# EAGLE design bateria EPS (EAGLE 9.6.1)
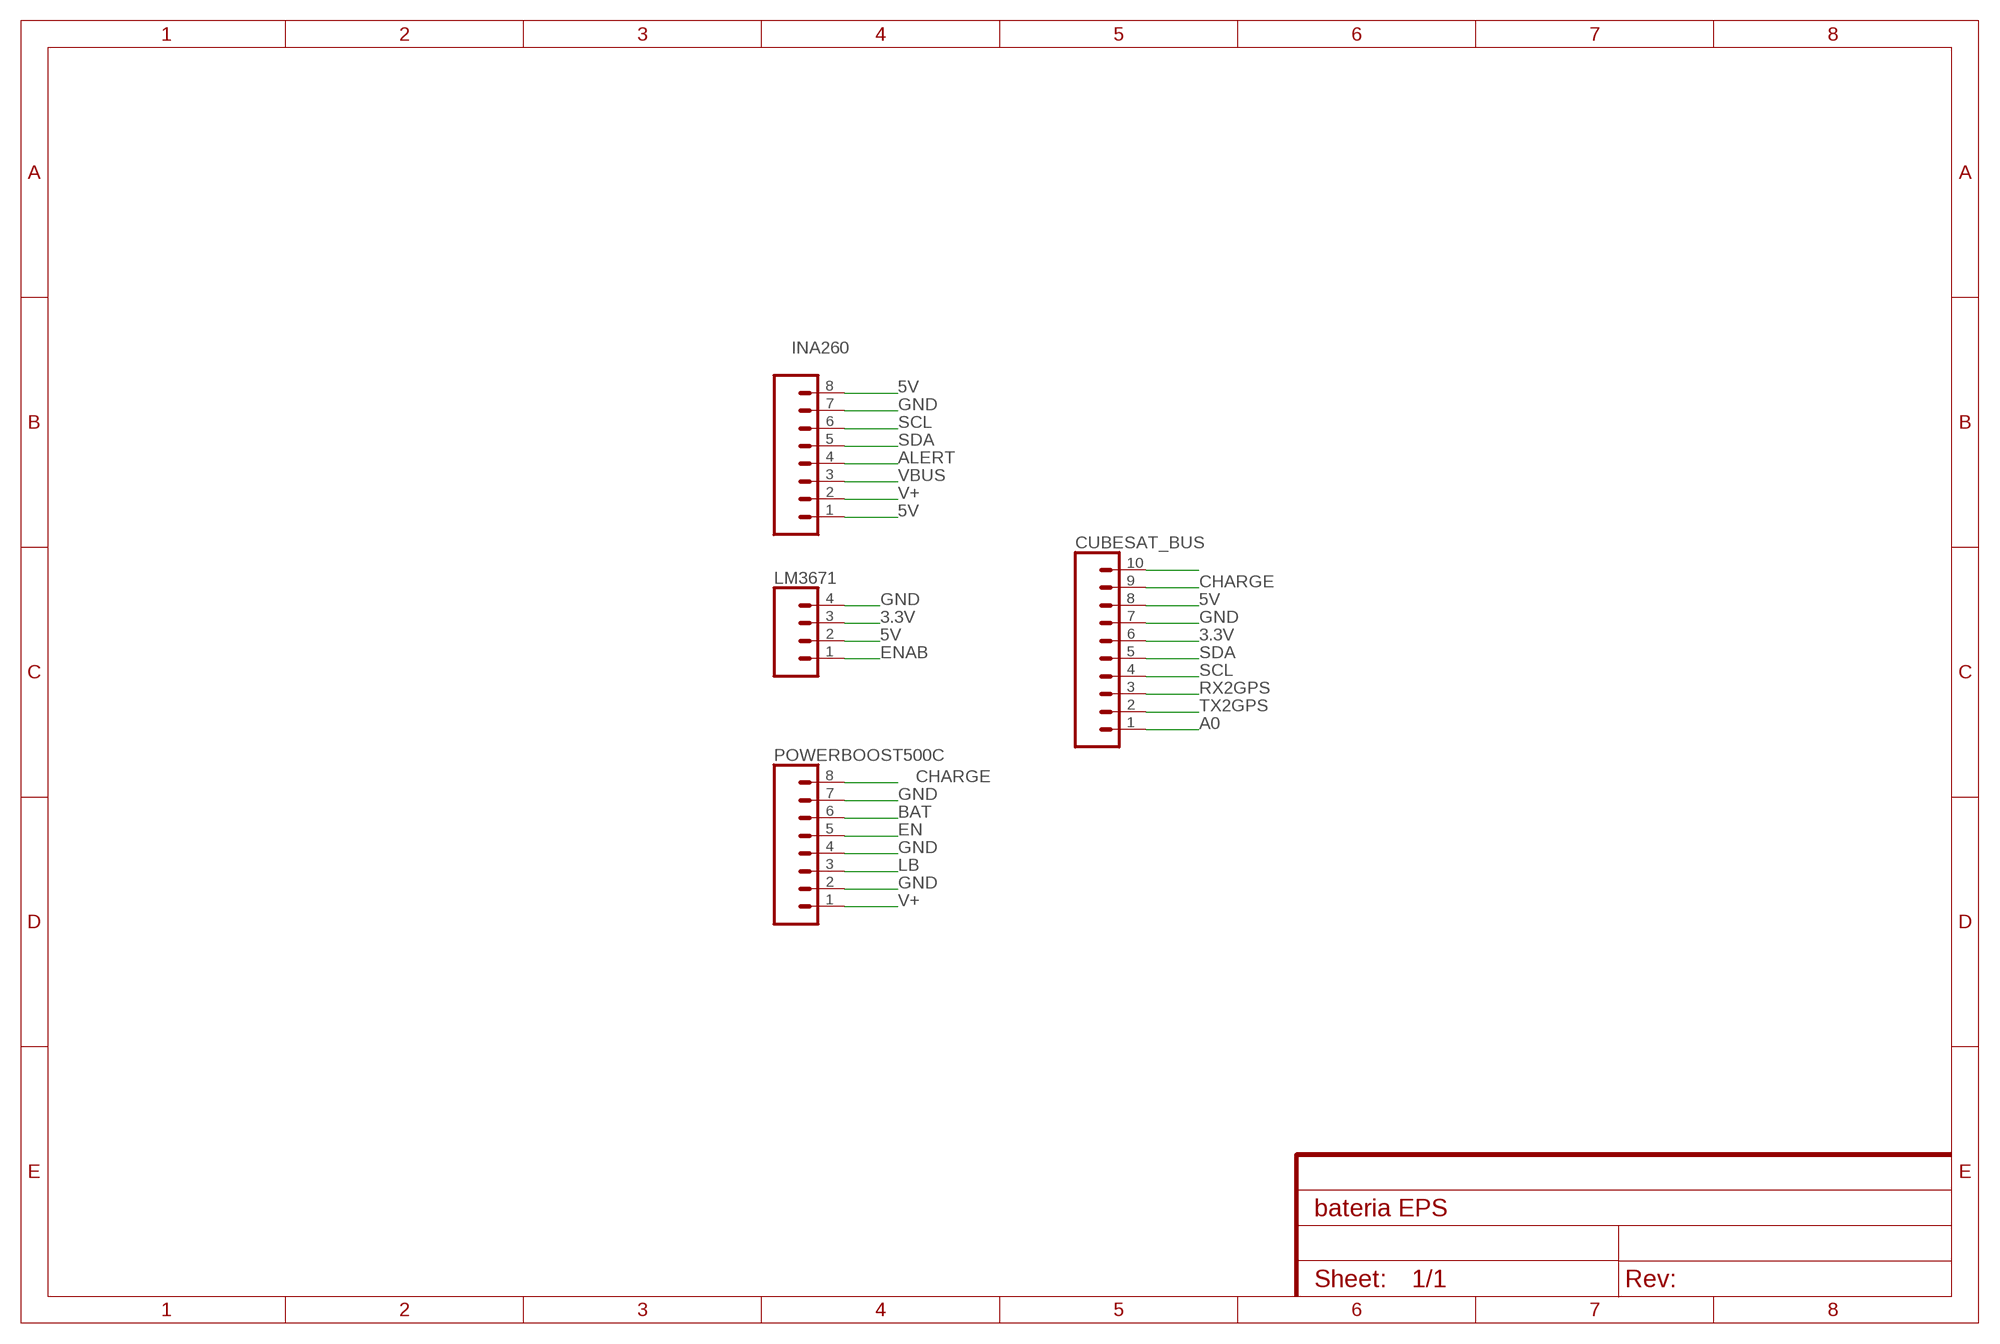
[diagram p0: schematic, sheet 1]

## Parts
CUBESAT_BUS  CONN_10"  [1X10]
INA260  CONN_08"  [1X08]
LM3671  CONN_04PTH  [1X04]
POWERBOOST500C  CONN_08"  [1X08]

## Nets
3.3V: CUBESAT_BUS.6 LM3671.3
5V: CUBESAT_BUS.8 INA260.1 INA260.8 LM3671.2
A0: CUBESAT_BUS.1
ALERT: INA260.4
BAT: POWERBOOST500C.6
CHARGE: CUBESAT_BUS.9 POWERBOOST500C.8
EN: POWERBOOST500C.5
ENAB: LM3671.1
GND: CUBESAT_BUS.7 INA260.7 LM3671.4 POWERBOOST500C.2 POWERBOOST500C.4 POWERBOOST500C.7
LB: POWERBOOST500C.3
N$20: CUBESAT_BUS.10
RX2GPS: CUBESAT_BUS.3
SCL: CUBESAT_BUS.4 INA260.6
SDA: CUBESAT_BUS.5 INA260.5
TX2GPS: CUBESAT_BUS.2
V+: INA260.2 POWERBOOST500C.1
VBUS: INA260.3

## Library data of the parts
CUBESAT_BUS = SparkFun-Connectors:CONN_10: Multi connection point. Often used as Generic Header-pin footprint for 0.1 inch spaced/style header connections On any of the 0.1 inch spaced packages, you can populate with these: Break Away Headers - Straight <https://www.sparkfun.com/products/116> (PRT-00116) Break Away Male Headers - Right Angle <https://www.sparkfun.com/products/553> (PRT-00553) Female Headers <https://www.sparkfun.com/products/115> (PRT-00115) Break Away Headers - Machine Pin <https://www.sparkfun.com/products/117> (PRT-00117) Break Away Female Headers - Swiss Machine Pin <https://www.sparkfun.com/products/743> (PRT-00743) Arduino Stackable Header - 10 Pin <https://www.sparkfun.com/products/11376> (PRT-11376) For SCREWTERMINALS and SPRING TERMINALS visit here: Screw Terimnals on SparkFun.com <https://www.sparkfun.com/search/results?term=Screw+Terminals> (5mm/3.5mm/2.54mm spacing) This device is also useful as a general connection point to wire up your design to another part of your project. Our various solder wires solder well into these plated through hole pads. Hook-Up Wire - Assortment (Stranded, 22 AWG) <https://www.sparkfun.com/products/11375> (PRT-11375) Hook-Up Wire - Assortment (Solid Core, 22 AWG) <https://www.sparkfun.com/products/11367> (PRT-11367) View the entire wire category on our website here <https://www.sparkfun.com/categories/141> Special notes: Molex polarized connector foot print use with SKU : PRT-08231 with associated crimp pins and housings. 1MM SMD Version SKU: PRT-10208 NOTES ON THE VARIANTS LOCK and LOCK_LONGPADS... This footprint was designed to help hold the alignment of a through-hole component (i.e. 6-pin header) while soldering it into place. You may notice that each hole has been shifted either up or down by 0.005 of an inch from it's more standard position (which is a perfectly straight line). This slight alteration caused the pins (the squares in the middle) to touch the edges of the holes. Because they are alternating, it causes a "brace" to hold the component in place. 0.005 has proven to be the perfect amount of "off-center" position when using our standard breakaway headers. Although looks a little odd when you look at the bare footprint, once you have a header in there, the alteration is very hard to notice. Also,if you push a header all the way into place, it is covered up entirely on the bottom side.; PROD_ID: CONN-11563
INA260 POWERBOOST500C = SparkFun-Connectors:CONN_08: Multi connection point. Often used as Generic Header-pin footprint for 0.1 inch spaced/style header connections On any of the 0.1 inch spaced packages, you can populate with these: Break Away Headers - Straight <https://www.sparkfun.com/products/116> (PRT-00116) Break Away Male Headers - Right Angle <https://www.sparkfun.com/products/553> (PRT-00553) Female Headers <https://www.sparkfun.com/products/115> (PRT-00115) Break Away Headers - Machine Pin <https://www.sparkfun.com/products/117> (PRT-00117) Break Away Female Headers - Swiss Machine Pin <https://www.sparkfun.com/products/743> (PRT-00743) Arduino Stackable Header - 8 Pin <https://www.sparkfun.com/products/9279> (PRT-09279) For SCREWTERMINALS and SPRING TERMINALS visit here: Screw Terimnals on SparkFun.com <https://www.sparkfun.com/search/results?term=Screw+Terminals> (5mm/3.5mm/2.54mm spacing) This device is also useful as a general connection point to wire up your design to another part of your project. Our various solder wires solder well into these plated through hole pads. Hook-Up Wire - Assortment (Stranded, 22 AWG) <https://www.sparkfun.com/products/11375> (PRT-11375) Hook-Up Wire - Assortment (Solid Core, 22 AWG) <https://www.sparkfun.com/products/11367> (PRT-11367) View the entire wire category on our website here <https://www.sparkfun.com/categories/141> Special notes: Molex polarized connector foot print use with SKU : PRT-08231 with associated crimp pins and housings. 1MM SMD Version SKU: PRT-10208 NOTES ON THE VARIANTS LOCK and LOCK_LONGPADS... This footprint was designed to help hold the alignment of a through-hole component (i.e. 6-pin header) while soldering it into place. You may notice that each hole has been shifted either up or down by 0.005 of an inch from it's more standard position (which is a perfectly straight line). This slight alteration caused the pins (the squares in the middle) to touch the edges of the holes. Because they are alternating, it causes a "brace" to hold the component in place. 0.005 has proven to be the perfect amount of "off-center" position when using our standard breakaway headers. Although looks a little odd when you look at the bare footprint, once you have a header in there, the alteration is very hard to notice. Also,if you push a header all the way into place, it is covered up entirely on the bottom side.; PROD_ID: CONN-08438
LM3671 = SparkFun-Connectors:CONN_04: Multi connection point. Often used as Generic Header-pin footprint for 0.1 inch spaced/style header connections On any of the 0.1 inch spaced packages, you can populate with these: Break Away Headers - Straight <https://www.sparkfun.com/products/116> (PRT-00116) Break Away Male Headers - Right Angle <https://www.sparkfun.com/products/553> (PRT-00553) Female Headers <https://www.sparkfun.com/products/115> (PRT-00115) Break Away Headers - Machine Pin <https://www.sparkfun.com/products/117> (PRT-00117) Break Away Female Headers - Swiss Machine Pin <https://www.sparkfun.com/products/743> (PRT-00743) For SCREWTERMINALS and SPRING TERMINALS visit here: Screw Terimnals on SparkFun.com <https://www.sparkfun.com/search/results?term=Screw+Terminals> (5mm/3.5mm/2.54mm spacing) This device is also useful as a general connection point to wire up your design to another part of your project. Our various solder wires solder well into these plated through hole pads. Hook-Up Wire - Assortment (Stranded, 22 AWG) <https://www.sparkfun.com/products/11375> (PRT-11375) Hook-Up Wire - Assortment (Solid Core, 22 AWG) <https://www.sparkfun.com/products/11367> (PRT-11367) View the entire wire category on our website here <https://www.sparkfun.com/categories/141> Special notes: Molex polarized connector foot print use with SKU : PRT-08231 with associated crimp pins and housings. 1MM SMD Version SKU: PRT-10208; PROD_ID: CONN-09696

## Board
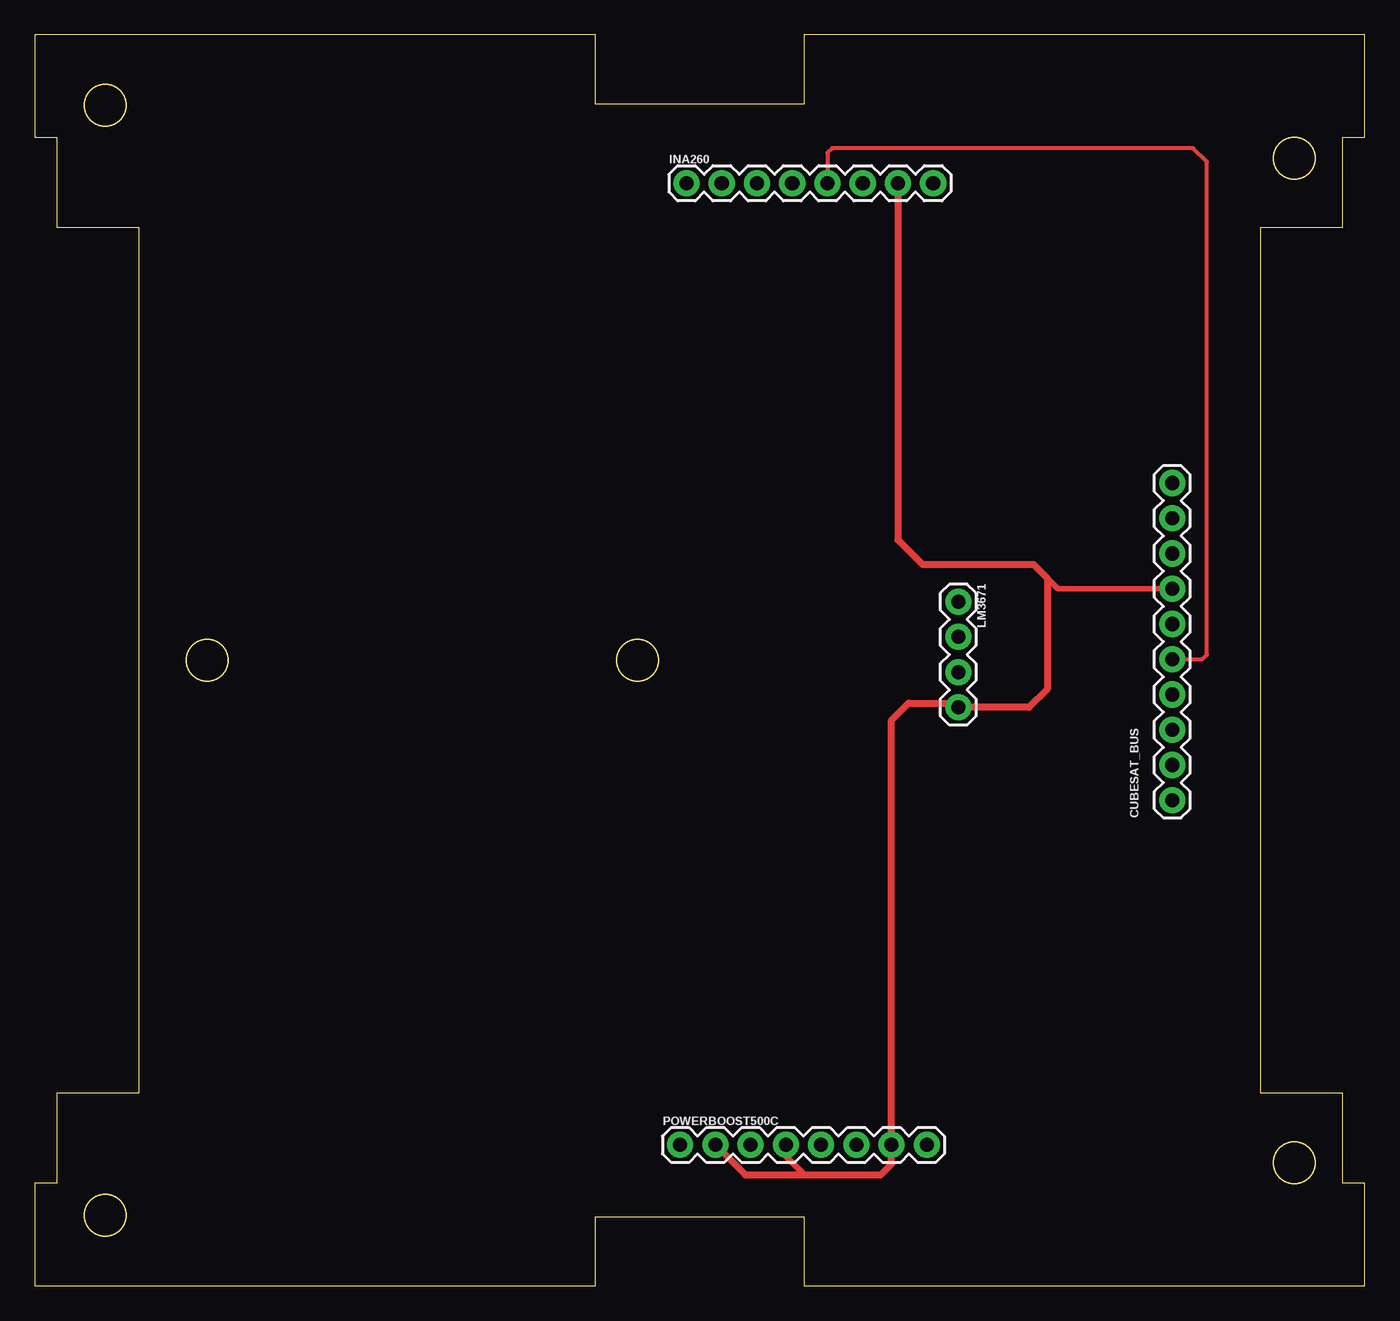
[diagram p1: board, top side]
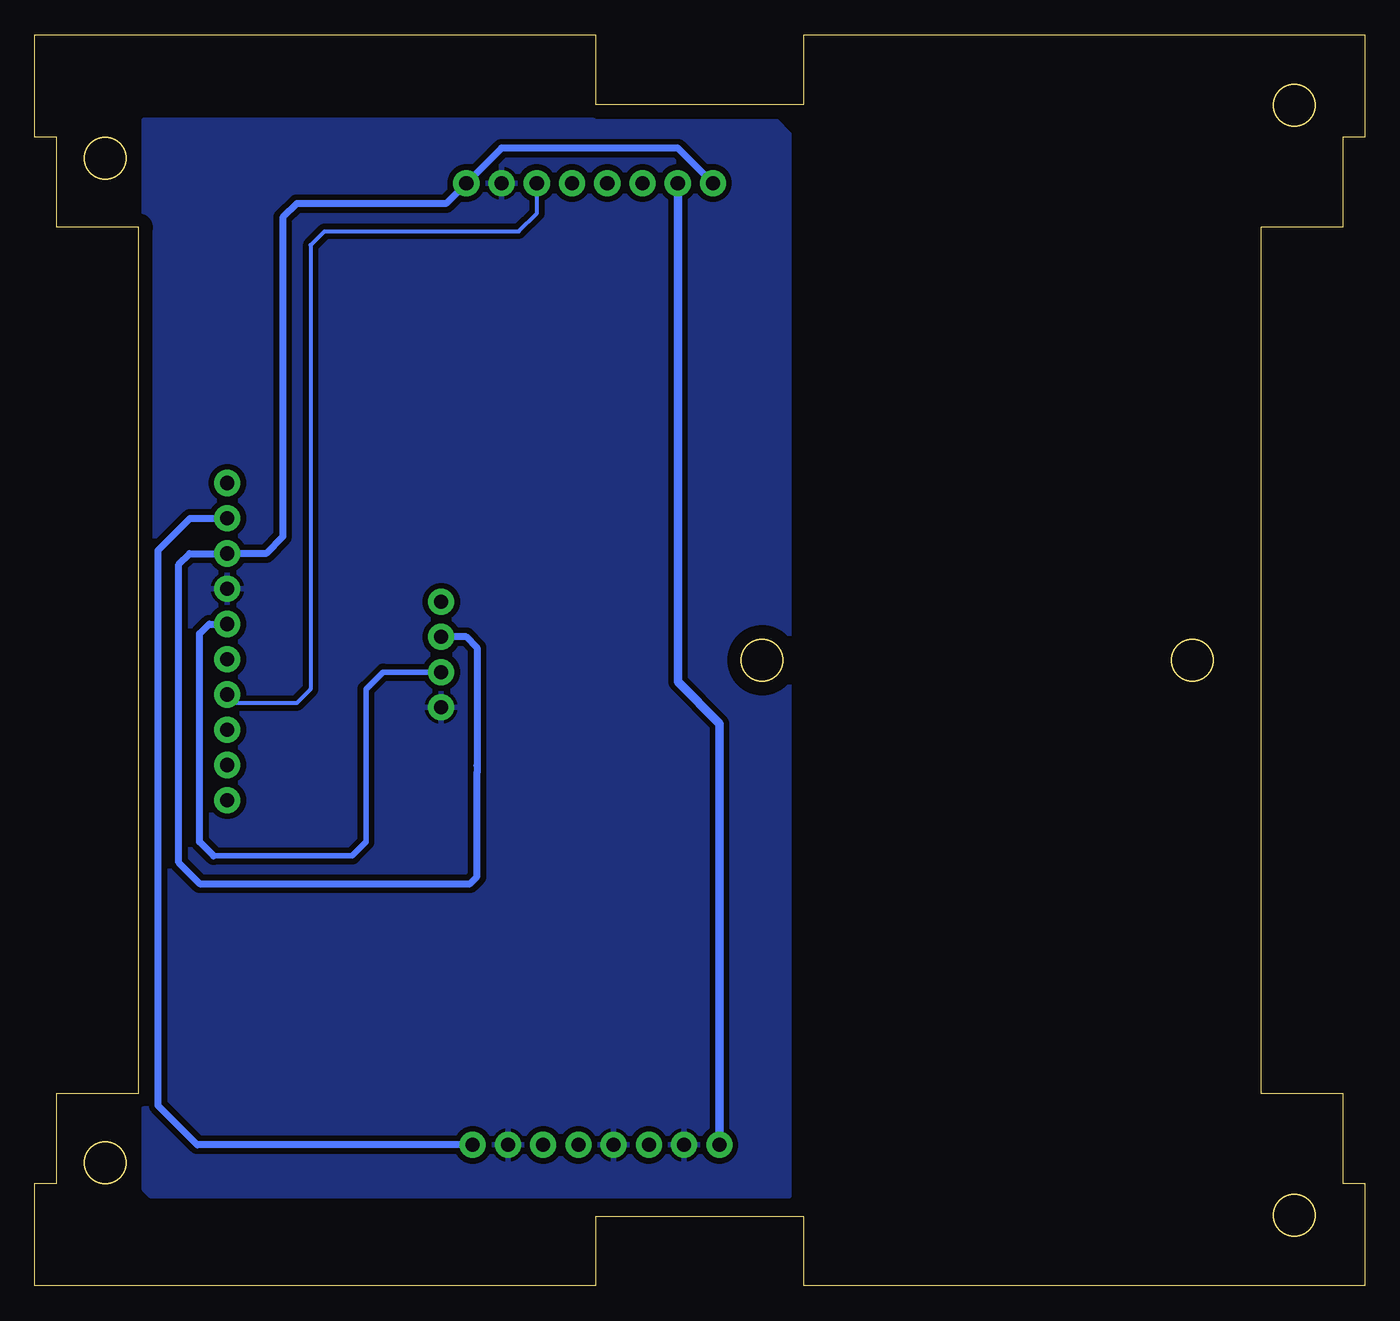
[diagram p2: board, bottom side, seen from below]

Size 95.89 x 90.17 mm. Coordinates in mm from the lower left corner, seen from the top.
Outline: 0,0 40.45,0 40.45,5 55.45,5 55.45,0 95.89,0 95.89,7.4 94.29,7.4 94.29,13.89 88.39,13.89 88.39,76.28 94.29,76.28 94.29,82.77 95.89,82.77 95.89,90.17 55.45,90.17 55.45,85.17 40.45,85.17 40.45,90.17 0,90.17 0,82.77 1.6,82.77 1.6,76.28 7.5,76.28 7.5,13.89 1.6,13.89 1.6,7.4 0,7.4 0,0
Outline: circle at 43.45,45.09 radius 1.5
Outline: circle at 5.08,85.09 radius 1.5
Outline: circle at 90.81,8.89 radius 1.5
Outline: circle at 12.45,45.09 radius 1.5
Outline: circle at 5.08,5.08 radius 1.5
Outline: circle at 90.81,81.28 radius 1.5
Copper layers (1*16): Top 0.035mm / dielectric 1.5mm / Bottom 0.035mm
Design rules "default *": minimum track width 10mil, minimum drill 0.35mm, track to track 10mil, track to pad 10mil, pad to pad 6mil, via to via 6mil, smd to smd 6mil, copper to edge 40mil, drill to drill 6mil, minimum pad ring 10mil, minimum via ring 8mil, stop-mask expansion 4mil, vias tented up to drill 0mil, thermal gap 10mil

### Footprints (pad centres in the part's own frame; a part is rotated, then mirrored left to right if it is on the bottom)
1X10 = drill 1.016 pad 1.88: 1 0,0; 2 2.54,0; 3 5.08,0; 4 7.62,0; 5 10.16,0; 6 12.7,0; 7 15.24,0; 8 17.78,0; 9 20.32,0; 10 22.86,0
1X08 = drill 1.016 pad 1.88: 1 0,0; 2 2.54,0; 3 5.08,0; 4 7.62,0; 5 10.16,0; 6 12.7,0; 7 15.24,0; 8 17.78,0
1X04 = drill 1.016 pad 1.88: 1 0,0; 2 2.54,0; 3 5.08,0; 4 7.62,0

### Placement (x,y rotation side)
CUBESAT_BUS  82,35 90 top
INA260  46.99,79.47 0 top
LM3671  66.58,49.31 270 top
POWERBOOST500C  46.53,10.16 0 top

### Tracks (layer width: path | path; a pad name or v marks a point on that pad's centre or on a via)
3.3V
  Bottom 0.406: 83,31 73,31 72,32 72,43 70.77,44.23 LM3671.3
  Bottom 0.508: 83,31 84,32 84,47 83.3,47.7 CUBESAT_BUS.6
5V
  Bottom 0.508: LM3671.2 64.77,46.77 64,46 64,37.5 64,37 64,29.5 64.5,29 84,29 85.5,30.5 85.5,52 84.72,52.78 CUBESAT_BUS.8 79.22,52.78 78,54 78,77 77,78 66.24,78 INA260.8 62.24,82 49.52,82 INA260.1
CHARGE
  Bottom 0.508: POWERBOOST500C.8 84.16,10.16 87,13 87,53 84.68,55.32 CUBESAT_BUS.9
GND
  Top 0.406: POWERBOOST500C.4 54.15,9.35 55.5,8 | 73,51 73.75,50.25 73.76,50.24 CUBESAT_BUS.7
  Top 0.508: POWERBOOST500C.2 51.23,8 55.5,8 61,8 61.77,8.77 POWERBOOST500C.7 61.77,40.77 63,42 66.69,42 67,41.69 LM3671.4 71.69,41.69 73,43 73,51 72,52 64,52 62.23,53.77 INA260.7
  pour Bottom (isolate 0.406): 41.5,83 41.5,6.5 87.5,6.5 88,7 88,84 42.5,84
SCL
  Bottom 0.305: CUBESAT_BUS.4 81.38,42 77,42 76,43 76,75 75,76 61,76 59.69,77.31 INA260.6
SDA
  Top 0.305: CUBESAT_BUS.5 84.16,45.16 84.5,45.5 84.5,81 83.5,82 57.5,82 57.15,81.65 INA260.5
V+
  Bottom 0.61: POWERBOOST500C.1 46.53,40.53 49.53,43.53 INA260.2